# EasyEDA Pro project ProPrj_X-Link_V9.3_M_2024-11-03.epro

# Schematic X-Link_V9.3_M
Board Name: X-Link_V9.3_M; Create Date: 2024-10-04; Page Name: X-Link_V9.3_M; Project Name: X-Link_V9.3_M; Schematic Name: X-Link_V9.3_M; Update Date: 2024-10-04; Company: 嘉立创EDA; Page Size: A4; Version: V1.0
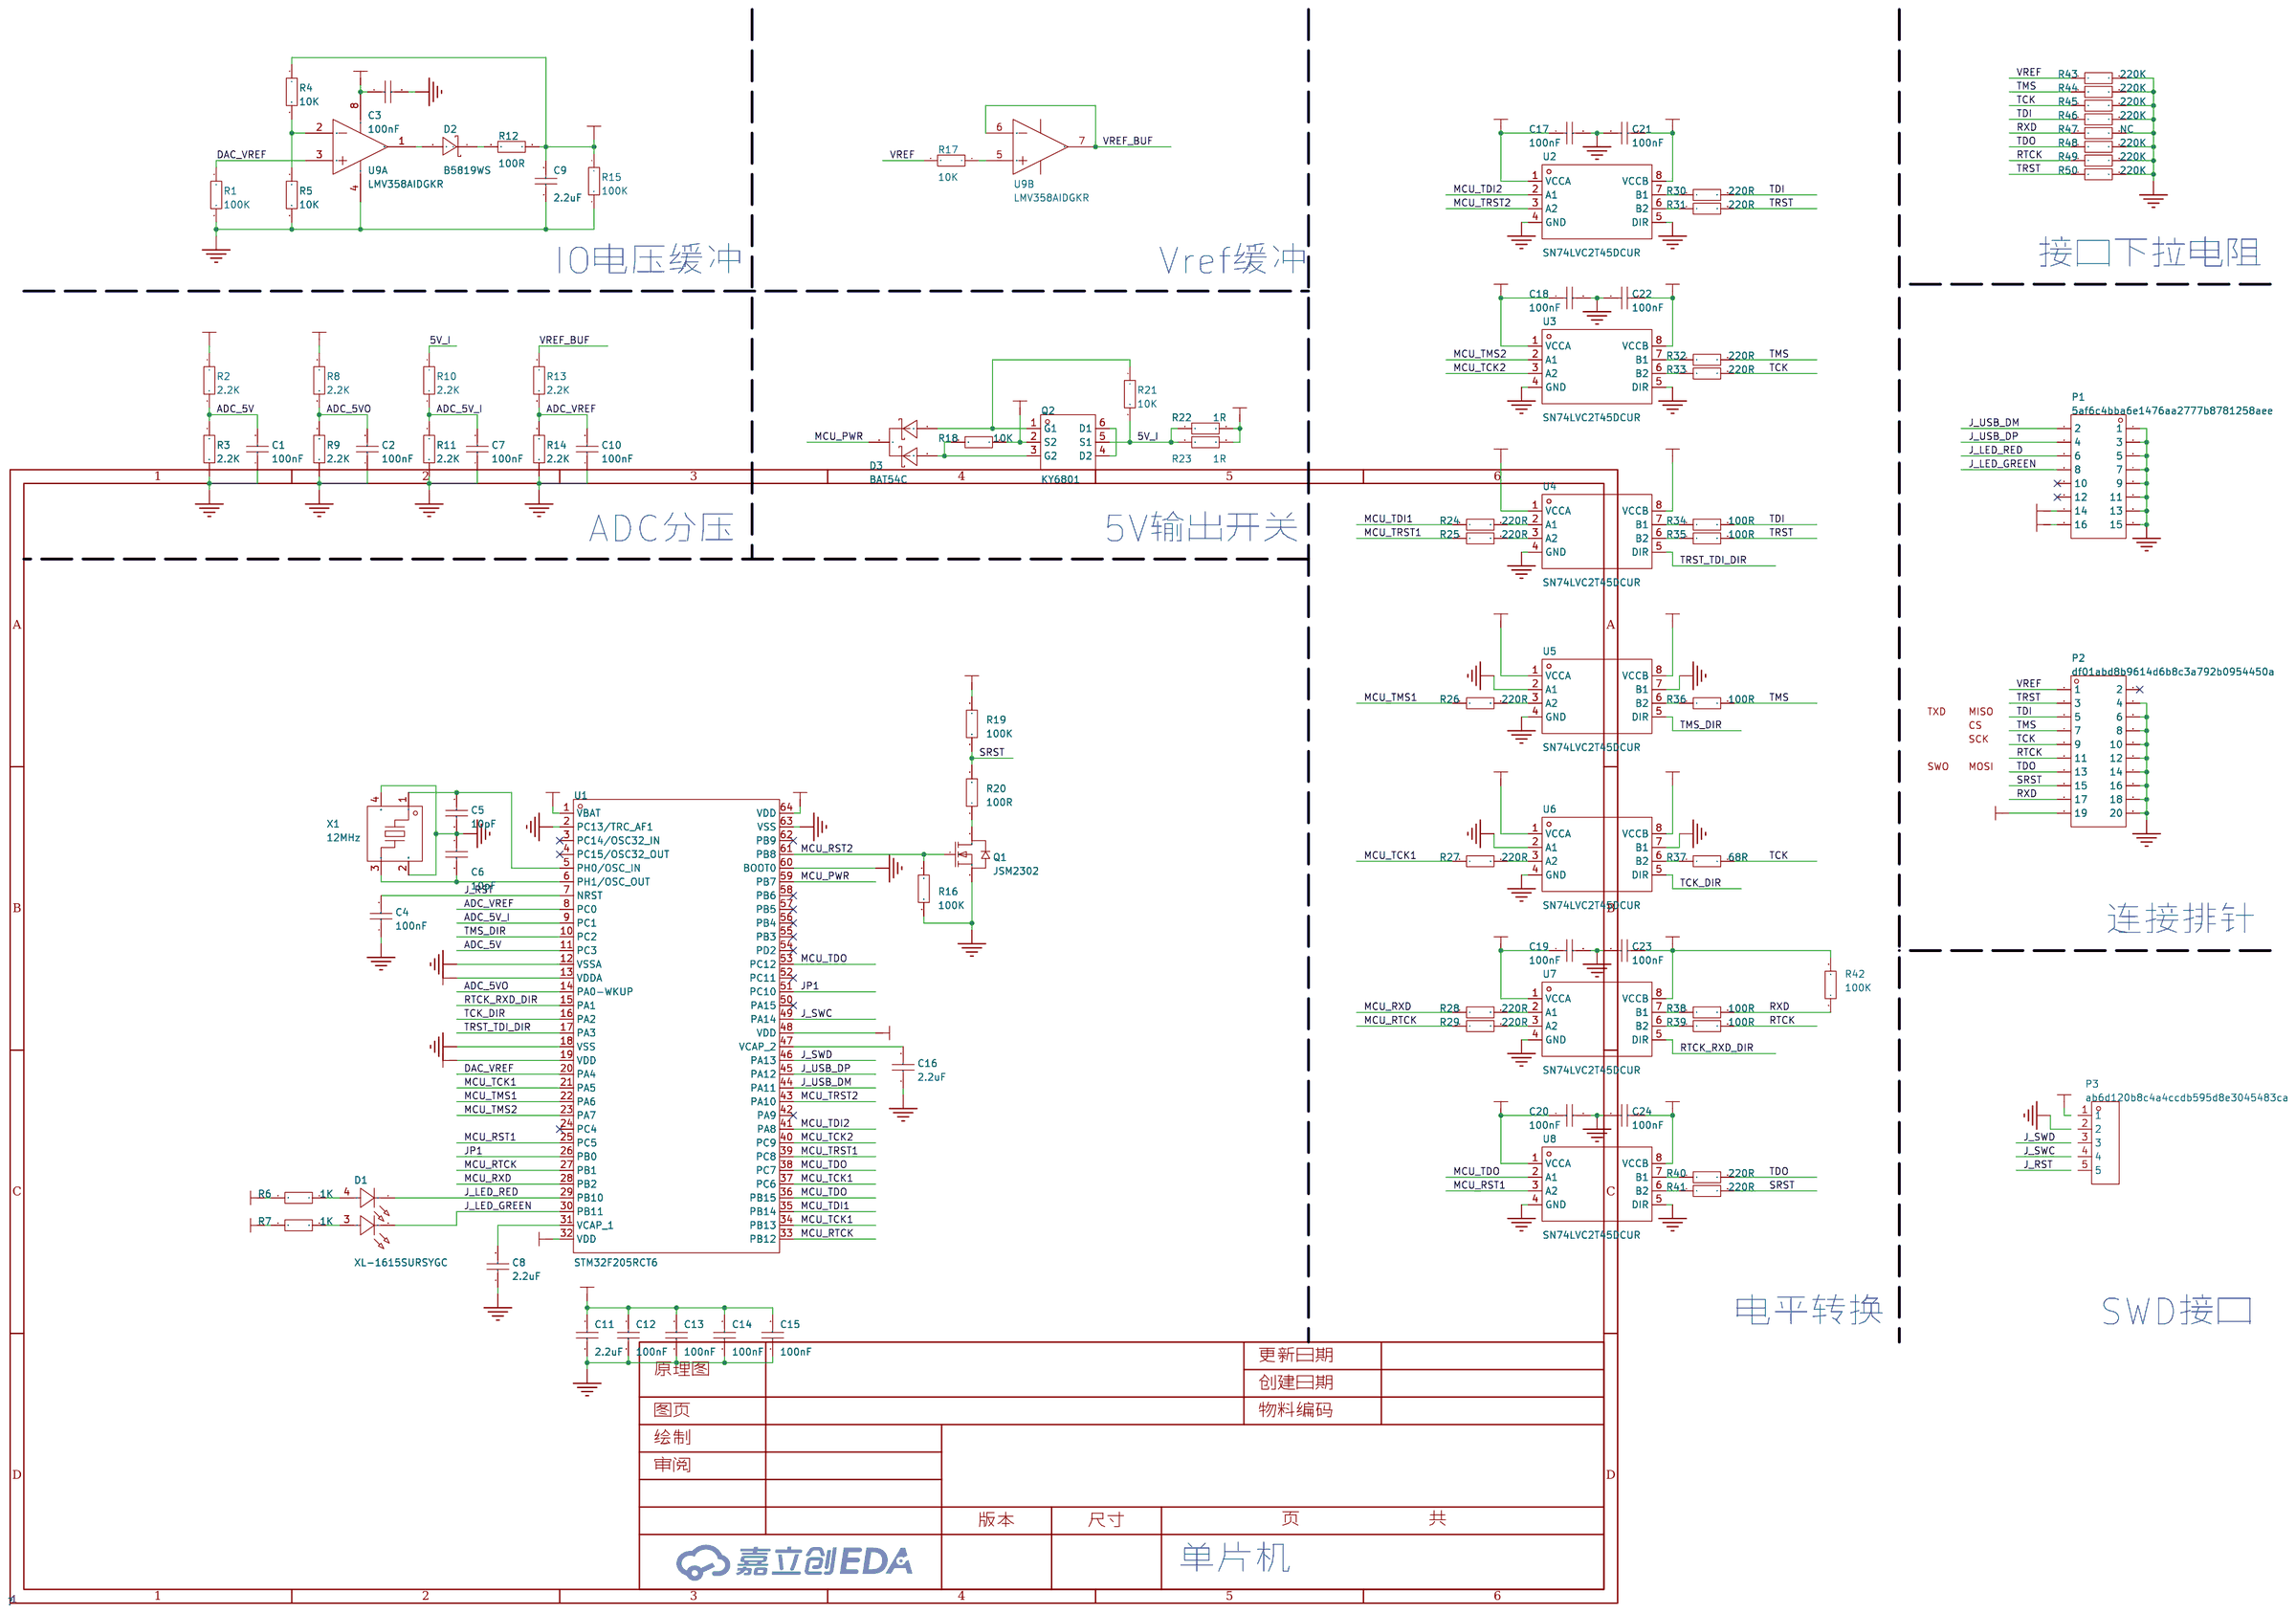
[diagram p0: schematic sheet]

## Parts
C1  100nF  [C0603]
C2  100nF  [C0603]
C3  100nF  [C0603]
C4  100nF  [C0603]
C5  10pF  [C0603]
C6  10pF  [C0603]
C7  100nF  [C0603]
C8  2.2uF  [C0603]
C9  2.2uF  [C0603]
C10  100nF  [C0603]
C11  2.2uF  [C0603]
C12  100nF  [C0603]
C13  100nF  [C0603]
C14  100nF  [C0603]
C15  100nF  [C0603]
C16  2.2uF  [C0603]
C17  100nF  [C0603]
C18  100nF  [C0603]
C19  100nF  [C0603]
C20  100nF  [C0603]
C21  100nF  [C0603]
C22  100nF  [C0603]
C23  100nF  [C0603]
C24  100nF  [C0603]
D1  XL-1615SURSYGC  [LED1615]
D2  B5819WS  [SOD-323_L1.8-W1.3-LS2.5-RD]
D3  BAT54C  [SOT-23-3_L2.9-W1.3-P1.90-LS2.4-BR]
P1  5af6c4bba6e1476aa2777b8781258aee  [HDR-TH_16P-P1.27-V-M-R2-C8-S1.27-1]
P2  df01abd8b9614d6b8c3a792b0954450a  [HDR-TH_20P-P1.27-V-M-R2-C10-S1.27]
P3  ab6d120b8c4a4ccdb595d8e3045483ca  [HDR-TH_5P-P1.27-V-M]
Q1  JSM2302  [SOT-23-3_L2.9-W1.3-P1.90-LS2.4-BR]
Q2  KY6801  [SOT-23-6_L2.9-W1.6-P0.95-LS2.8-BR]
R1  100K  [R0603]
R2  2.2K  [R0603]
R3  2.2K  [R0603]
R4  10K  [R0603]
R5  10K  [R0603]
R6  1K  [R0603]
R7  1K  [R0603]
R8  2.2K  [R0603]
R9  2.2K  [R0603]
R10  2.2K  [R0603]
R11  2.2K  [R0603]
R12  100R  [R0603]
R13  2.2K  [R0603]
R14  2.2K  [R0603]
R15  100K  [R0603]
R16  100K  [R0603]
R17  10K  [R0603]
R18  10K  [R0603]
R19  100K  [R0603]
R20  100R  [R0603]
R21  10K  [R0603]
R22  1R  [R0805]
R23  1R  [R0805]
R24  220R  [R0603]
R25  220R  [R0603]
R26  220R  [R0603]
R27  220R  [R0603]
R28  220R  [R0603]
R29  220R  [R0603]
R30  220R  [R0603]
R31  220R  [R0603]
R32  220R  [R0603]
R33  220R  [R0603]
R34  100R  [R0603]
R35  100R  [R0603]
R36  100R  [R0603]
R37  68R  [R0603]
R38  100R  [R0603]
R39  100R  [R0603]
R40  220R  [R0603]
R41  220R  [R0603]
R42  100K  [R0603]
R43  220K  [R0603]
R44  220K  [R0603]
R45  220K  [R0603]
R46  220K  [R0603]
R47  NC  [R0603]
R48  220K  [R0603]
R49  220K  [R0603]
R50  220K  [R0603]
U1  STM32F205RCT6  [LQFP-64_L10.0-W10.0-P0.50-LS12.0-BL]
U2  SN74LVC2T45DCUR  [VSSOP-8_L2.4-W2.1-P0.50-LS3.2-BR]
U3  SN74LVC2T45DCUR  [VSSOP-8_L2.4-W2.1-P0.50-LS3.2-BR]
U4  SN74LVC2T45DCUR  [VSSOP-8_L2.4-W2.1-P0.50-LS3.2-BR]
U5  SN74LVC2T45DCUR  [VSSOP-8_L2.4-W2.1-P0.50-LS3.2-BR]
U6  SN74LVC2T45DCUR  [VSSOP-8_L2.4-W2.1-P0.50-LS3.2-BR]
U7  SN74LVC2T45DCUR  [VSSOP-8_L2.4-W2.1-P0.50-LS3.2-BR]
U8  SN74LVC2T45DCUR  [VSSOP-8_L2.4-W2.1-P0.50-LS3.2-BR]
U9  LMV358AIDGKR  [VSSOP-8_L3.0-W3.0-P0.65-LS5.0-BL]  (sections 1,2)
X1  12MHz  [CRYSTAL-SMD_4P-L3.2-W2.5-BL-A]

## Library data of the parts
C1-C24 = C0603
D1 = LED1615: Emitted Color: 红色,黄绿色; Manufacturer: XINGLIGHT(成兴光); Supplier: LCSC; Supplier Part: C965838
D2 = B5819WS_C22624: 正向压降(Vf):600mV@1A;直流反向耐压(Vr):40V;平均整流电流(Io):1A;; LCSC Part Name: 电压:40V 电流:1A; Supplier Part: C22624; Manufacturer: CJ(江苏长电/长晶); Supplier Footprint: SOD-323; JLCPCB Part Class: 扩展库; Datasheet: https://atta.szlcsc.com/upload/public/pdf/source/20150407/1457707273359.pdf; Supplier: LCSC; Forward Voltage (Vf@If): 600mV@1A; Reverse Voltage (Vr): 40V; Average Rectified Current (Io): 1A
D3 = BAT54C_C916424: 二极管配置:1对共阴极;正向压降(Vf):1V@100mA;直流反向耐压(Vr):30V;整流电流:200mA;; LCSC Part Name: 电压:30V 电流:200mA; Supplier Part: C916424; Manufacturer: JSMSEMI(杰盛微); Supplier Footprint: SOT-23; JLCPCB Part Class: Extended Part; Datasheet: https://atta.szlcsc.com/upload/public/pdf/source/20230807/4DC032BFF2527F74FFA5A2420773D8A6.pdf; Supplier: LCSC; Diode Configuration: 1对共阴极; Forward Voltage (Vf@If): 1V@100mA; Reverse Voltage (Vr): 30V; Rectified Current: 200mA; Reverse Leakage Current (Ir): 2uA@25V
P1 = HDR2x8_1.27: 插针结构:2x8P;间距:1.27mm;行距:1.27mm;圆针/方针:方针;安装类型:直插;排数:双排;总PIN位数:16P;额定电流:1A;额定电压:500V;配合针长度:3.8mm;塑高:1mm;端接针长度:2.4mm;触头材质:黄铜;触头镀层:-;工作温度范围:-40℃~+105℃;焊接温度(最大值):260℃@10S;颜色:黑色;; LCSC Part Name: 2x8P 间距:1.27mm 方针 直插; Supplier Footprint: 插件,P=1.27mm; JLCPCB Part Class: 扩展库; Datasheet: https://atta.szlcsc.com/upload/public/pdf/source/20230314/463801427F572AD42B1A6214765822D0.pdf; Pin Structure: 2x8P; Pitch: 1.27mm; Row Spacing: 1.27mm; Circluar Pins/Square Pins: 方针; Mounting Type: 直插; Number of Rows: 双排; Number of Pins: 16P; Current Rating (Max): 1A; Voltage Rating (Max): 500V; Length of Mating Pin: 3.8mm; Insulation Height: 1mm; Length of End Connection Pin: 2.4mm; Contact Material: 黄铜; Operating Temperature Range: -40℃~+105℃; Soldering Temperature(Max): 260℃@10S; Color: 黑色
P2 = HDR2x10_1.27: 插针结构:2x10P;间距:1.27mm;行距:1.27mm;圆针/方针:方针;安装类型:直插;排数:双排;总PIN位数:20P;额定电流:1A;额定电压:500V;配合针长度:3.8mm;塑高:1mm;端接针长度:2.4mm;触头材质:黄铜;触头镀层:-;工作温度范围:-40℃~+105℃;焊接温度(最大值):260℃@10S;颜色:黑色;; LCSC Part Name: 2x10P 间距:1.27mm 方针 直插; Supplier Footprint: 插件,P=1.27mm; JLCPCB Part Class: 扩展库; Datasheet: https://atta.szlcsc.com/upload/public/pdf/source/20240702/A94E5E2C58EC168531668174128D95E4.pdf; Pin Structure: 2x10P; Pitch: 1.27mm; Row Spacing: 1.27mm; Circluar Pins/Square Pins: 方针; Mounting Type: 直插; Number of Rows: 双排; Number of Pins: 20P; Current Rating (Max): 1A; Voltage Rating (Max): 500V; Length of Mating Pin: 3.8mm; Insulation Height: 1mm; Length of End Connection Pin: 2.4mm; Contact Material: 黄铜; Operating Temperature Range: -40℃~+105℃; Soldering Temperature(Max): 260℃@10S; Color: 黑色
P3 = HDR1x5_1.27: 插针结构:1x5P;间距:1.27mm;行距:-;圆针/方针:方针;安装类型:直插;排数:单排;总PIN位数:5P;额定电流:1A;额定电压:250V;配合针长度:3.8mm;塑高:1mm;端接针长度:2.4mm;触头材质:黄铜;触头镀层:-;工作温度范围:-40℃~+105℃;焊接温度(最大值):260℃@10S;颜色:黑色;; LCSC Part Name: 1x5P 间距:1.27mm 方针 直插; Supplier Footprint: 插件,P=1.27mm; JLCPCB Part Class: 扩展库; Datasheet: https://atta.szlcsc.com/upload/public/pdf/source/20230316/674E7855FAF1BFD827413D68A2D1697C.pdf; Pin Structure: 1x5P; Pitch: 1.27mm; Circluar Pins/Square Pins: 方针; Mounting Type: 直插; Number of Rows: 单排; Number of Pins: 5P; Current Rating (Max): 1A; Voltage Rating (Max): 250V; Length of Mating Pin: 3.8mm; Insulation Height: 1mm; Length of End Connection Pin: 2.4mm; Contact Material: 黄铜; Operating Temperature Range: -40℃~+105℃; Soldering Temperature(Max): 260℃@10S; Color: 黑色
Q1 = JSM2302: 类型:1个N沟道;漏源电压(Vdss):20V;连续漏极电流(Id):6A;导通电阻(RDS(on)@Vgs,Id):60mΩ@4.5V,3.6A;功率(Pd):1.25W;阈值电压(Vgs(th)@Id):1.2V@250uA;; LCSC Part Name: 1个N沟道 耐压:20V 电流:6A; Supplier Part: C916403; Manufacturer: JSMSEMI(杰盛微); Supplier Footprint: SOT-23; JLCPCB Part Class: Extended Part; Datasheet: https://atta.szlcsc.com/upload/public/pdf/source/20230807/04B947337E4164AAEE3E50621783DB01.pdf; Supplier: LCSC; Type: 1个N沟道; Drain Source Voltage (Vdss): 20V; Continuous Drain Current (Id): 6A; Drain Source On Resistance (RDS(on)@Vgs,Id): 60mΩ@4.5V,3.6A; Power Dissipation (Pd): 1.25W; Gate Threshold Voltage (Vgs(th)@Id): 1.2V@250uA; Input Capacitance (Ciss@Vds): 300pF@15V; Reverse Transfer Capacitance (Crss@Vds): 80pF@15V
Q2 = KY6801: 类型:2个P沟道;漏源电压(Vdss):20V;连续漏极电流(Id):2A;功率(Pd):800mW;导通电阻(RDS(on)@Vgs,Id):120mΩ@4.5V,2A;阈值电压(Vgs(th)@Id):650mV@250uA;; LCSC Part Name: 2个P沟道 耐压:20V 电流:2A; Supplier Part: C3029283; Manufacturer: KY(韩景元); Supplier Footprint: SOT-23-6L; JLCPCB Part Class: Extended Part; Datasheet: https://atta.szlcsc.com/upload/public/pdf/source/20220602/4088AB0D899E527C37AFDEC1350C0A99.pdf; Supplier: LCSC; Type: 2个P沟道; Drain Source Voltage (Vdss): 20V; Continuous Drain Current (Id): 2A; Power Dissipation (Pd): 800mW; Drain Source On Resistance (RDS(on)@Vgs,Id): 120mΩ@4.5V,2A; Gate Threshold Voltage (Vgs(th)@Id): 650mV@250uA; Total Gate Charge (Qg@Vgs): 5.3nC@4.5V; Input Capacitance (Ciss@Vds): 250pF@10V; Reverse Transfer Capacitance (Crss@Vds): 18pF@10V; Operating Temperature: -55℃~+150℃@(Tj)
R1-R21 R24-R50 = R0603
R22 R23 = R0805: Tolerance: ±1%; Power(Watts): 125mW; Overload Voltage (Max): 150V
U1 = STM32F205RCT6: CPU内核:CM3;程序存储容量:256KB;GPIO端口数量:51;工作电压范围:1.8V~3.6V;CPU最大主频:120MHz;; Supplier Part: C47520; Manufacturer: ST(意法半导体); Supplier Footprint: LQFP-64(10x10); JLCPCB Part Class: 扩展库; Datasheet: https://atta.szlcsc.com/upload/public/pdf/source/20151106/1457707552494.pdf; Supplier: LCSC; CPU Core: CM3; Program Storage Size: 256KB; GPIO Ports Number: 51; Operating Voltage Range: 1.8V~3.6V; CPU Maximum Speed: 120MHz; Operating Temperature Range: -40℃~+85℃; ADC (Bit): 12bit; DAC (Bit): 12bit; Universal Serial Bus: 有; Watchdog: 有; Infrared Data Association: 有; Low-Voltage Detect: 有; LCD Module: 有; Direct Memory Access: 有; Internal Oscillator: 有
U2-U8 = SN74LVC2T45DCUR: SN74LVC2T45 具有可配置电压转换和三态输出的 2 位双电源总线收发器; Supplier Part: C15741; Manufacturer: TI(德州仪器); Supplier Footprint: VSSOP-8-0.5mm; JLCPCB Part Class: 扩展库; Datasheet: https://www.ti.com/cn/lit/gpn/sn74lvc2t45; Supplier: LCSC
U9 = LMV358AIDGKR: 放大器数:双路;增益带宽积(GBP):1MHz;输入偏置电流(Ib):10pA;压摆率(SR):1.7V/us;带宽(-3db):-;轨到轨:-;; Supplier Part: C408974; Manufacturer: TI(德州仪器); Supplier Footprint: VSSOP-8; JLCPCB Part Class: 扩展库; Datasheet: https://www.ti.com/cn/lit/gpn/lmv358a; Supplier: LCSC; Number of Circuits: 双路; Gain Bandwidth Product(GBP): 1MHz; Current - Input Bias(Ib): 10pA; Slew Rate(SR): 1.7V/us; Output Current: 40mA; Operating Temperature: -40℃~+125℃
X1 = XTAL3225

## Nets
3.3V: C11.2 C12.2 C13.2 C14.2 C15.2 C17.1 C18.1 C19.1 C20.1 P1.14 R6.2 R7.2 U1.1(VBAT) U1.13(VDDA) U1.19(VDD) U1.32(VDD) U1.48(VDD) U1.64(VDD) U2.1(VCCA) U3.1(VCCA) U4.1(VCCA) U5.1(VCCA) U6.1(VCCA) U7.1(VCCA) U8.1(VCCA)
5V: C3.1 P1.16 R2.1 R22.2 R23.2 U9.8(V+)
5V_I: Q2.5(S1) R10.1 R21.2 R22.1 R23.1
5V_OUT: P2.19 Q2.2(S2) R8.1 R18.1
GND: C1.1 C2.1 C3.2 C4.1 C5.2 C6.1 C7.1 C8.1 C9.1 C10.1 C11.1 C12.1 C13.1 C14.1 C15.1 C16.1 C17.2 C18.2 C19.2 C20.2 C21.1 C22.1 C23.1 C24.1 P1.1 P1.3 P1.5 P1.7 P1.9 P1.11 P1.13 P1.15 P2.4 P2.6 P2.8 P2.10 P2.12 P2.14 P2.16 P2.18 P2.20 Q1.2(S) R1.2 R3.2 R5.2 R9.2 R11.2 R14.2 R15.2 R16.2 R43.2 R44.2 R45.2 R46.2 R47.2 R48.2 R49.2 R50.2 U1.2(PC13/TRC_AF1) U1.12(VSSA) U1.18(VSS) U1.60(BOOT0) U1.63(VSS) U2.4(GND) U2.5(DIR) U3.4(GND) U3.5(DIR) U4.4(GND) U5.2(A1) U5.4(GND) U5.7(B1) U6.2(A1) U6.4(GND) U6.7(B1) U7.4(GND) U8.4(GND) U8.5(DIR) U9.4(V-) X1.2(GND) X1.4(GND)
ADC_5V: C1.2 R2.2 R3.1 U1.11(PC3)
ADC_5V_I: C7.2 R10.2 R11.1 U1.9(PC1)
ADC_5VO: C2.2 R8.2 R9.1 U1.14(PA0-WKUP)
ADC_VREF: C10.2 R13.2 R14.1 U1.8(PC0)
DAC_VREF: R1.1 U1.20(PA4) U9.3(+INA)
J_LED_GREEN: D1.2(K) P1.8 U1.30(PB11)
J_LED_RED: D1.1(K) P1.6 U1.29(PB10)
J_RST: C4.2 U1.7(NRST)
J_SWC: U1.49(PA14)
J_SWD: U1.46(PA13)
J_USB_DM: P1.2 U1.44(PA11)
J_USB_DP: P1.4 U1.45(PA12)
JP1: U1.26(PB0) U1.51(PC10)
MCU_PWR: D3.3(K) U1.59(PB7)
MCU_RST1: U1.25(PC5) U8.3(A2)
MCU_RST2: Q1.1(G) R16.1 U1.61(PB8)
MCU_RTCK: R29.1 U1.27(PB1) U1.33(PB12)
MCU_RXD: R28.1 U1.28(PB2)
MCU_TCK1: R27.1 U1.21(PA5) U1.34(PB13) U1.37(PC6)
MCU_TCK2: U1.40(PC9) U3.3(A2)
MCU_TDI1: R24.1 U1.35(PB14)
MCU_TDI2: U1.41(PA8) U2.2(A1)
MCU_TDO: U1.36(PB15) U1.38(PC7) U1.53(PC12) U8.2(A1)
MCU_TMS1: R26.1 U1.22(PA6)
MCU_TMS2: U1.23(PA7) U3.2(A1)
MCU_TRST1: R25.1 U1.39(PC8)
MCU_TRST2: U1.43(PA10) U2.3(A2)
RTCK: P2.11 R39.2 R49.1
RTCK_RXD_DIR: U1.15(PA1) U7.5(DIR)
RXD: P2.17 R38.2 R42.1 R47.1
SRST: P2.15 R19.2 R20.2 R41.2
TCK: P2.9 R33.2 R37.2 R45.1
TCK_DIR: U1.16(PA2) U6.5(DIR)
TDI: P2.5 R30.2 R34.2 R46.1
TDO: P2.13 R40.2 R48.1
TMS: P2.7 R32.2 R36.2 R44.1
TMS_DIR: U1.10(PC2) U5.5(DIR)
TRST: P2.3 R31.2 R35.2 R50.1
TRST_TDI_DIR: U1.17(PA3) U4.5(DIR)
VIO: C9.2 C21.2 C22.2 C23.2 C24.2 R4.1 R12.1 R15.1 R19.1 R42.2 U2.8(VCCB) U3.8(VCCB) U4.8(VCCB) U5.8(VCCB) U6.8(VCCB) U7.8(VCCB) U8.8(VCCB)
VREF: P2.1 R17.2 R43.1
VREF_BUF: R13.1 U9.6(-INB) U9.7(OUTB)
$1N1650: R31.1 U2.6(B2)
$1N1652: R30.1 U2.7(B1)
$1N2320: R32.1 U3.7(B1)
$1N2323: R33.1 U3.6(B2)
$1N2654: R34.1 U4.7(B1)
$1N2657: R35.1 U4.6(B2)
$1N2922: R36.1 U5.6(B2)
$1N3257: R24.2 U4.2(A1)
$1N3292: R25.2 U4.3(A2)
$1N3327: R26.2 U5.3(A2)
$1N3604: R27.2 U6.3(A2)
$1N3606: R37.1 U6.6(B2)
$1N3911: R38.1 U7.7(B1)
$1N3912: R39.1 U7.6(B2)
$1N3913: R28.2 U7.2(A1)
$1N3915: R29.2 U7.3(A2)
$1N4922: R40.1 U8.7(B1)
$1N4923: R41.1 U8.6(B2)
$1N5088: C5.1 U1.5(PH0/OSC_IN) X1.1
$1N5089: C6.2 U1.6(PH1/OSC_OUT) X1.3
$1N5338: C16.2 U1.47(VCAP_2)
$1N5416: C8.2 U1.31(VCAP_1)
$1N6080: D1.4(A) R6.1
$1N6144: D1.3(A) R7.1
$1N6676: R17.1 U9.5(+INB)
$1N6686: R4.2 R5.1 U9.2(-INA)
$1N9976: D2.2(A) U9.1(OUTA)
$1N10015: D2.1(K) R12.2
$1N10974: D3.2(A2) Q2.1(G1) R21.1
$1N10976: D3.1(A1) Q2.3(G2) R18.2
$1N10979: Q2.4(D2) Q2.6(D1)
$1N11150: Q1.3(D) R20.1

Not connected (* = marked no-connect by the designer): P1 10* 12*; P2 2*; P3 1 2 3 4 5; U1 3(PC14/OSC32_IN)* 4(PC15/OSC32_OUT)* 24(PC4)* 42(PA9)* 50(PA15)* 52(PC11)* 54(PD2)* 55(PB3)* 56(PB4)* 57(PB5)* 58(PB6)* 62(PB9)*

## Notes on the sheet
- 接口下拉电阻
- IO电压缓冲
- Vref缓冲
- ADC分压
- 5V输出开关
- TXD
- CS
- MISO
- SCK
- SWO
- MOSI
- 连接排针
- 电平转换
- SWD接口
- 单片机

# Board X-Link_V9.3_M
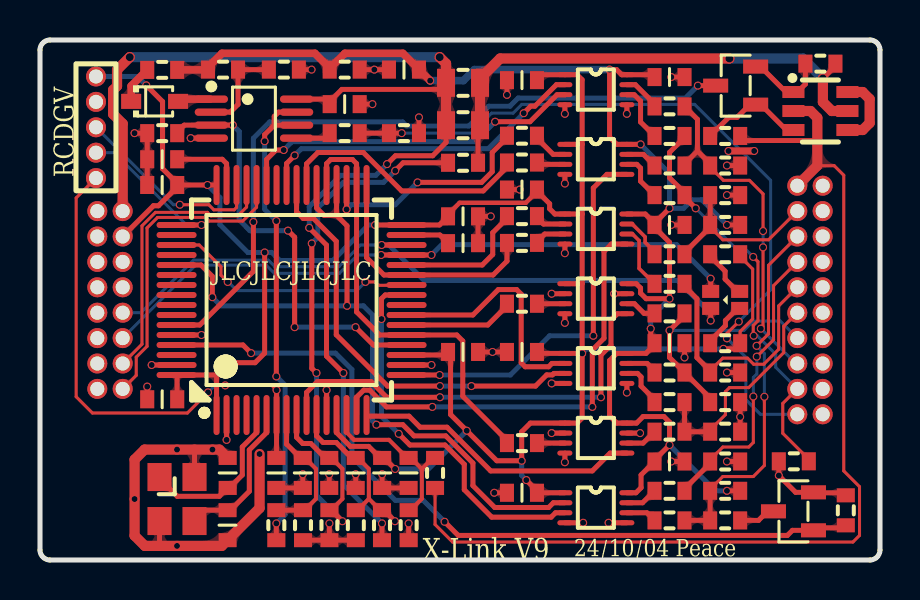
[diagram p1: board, top side]
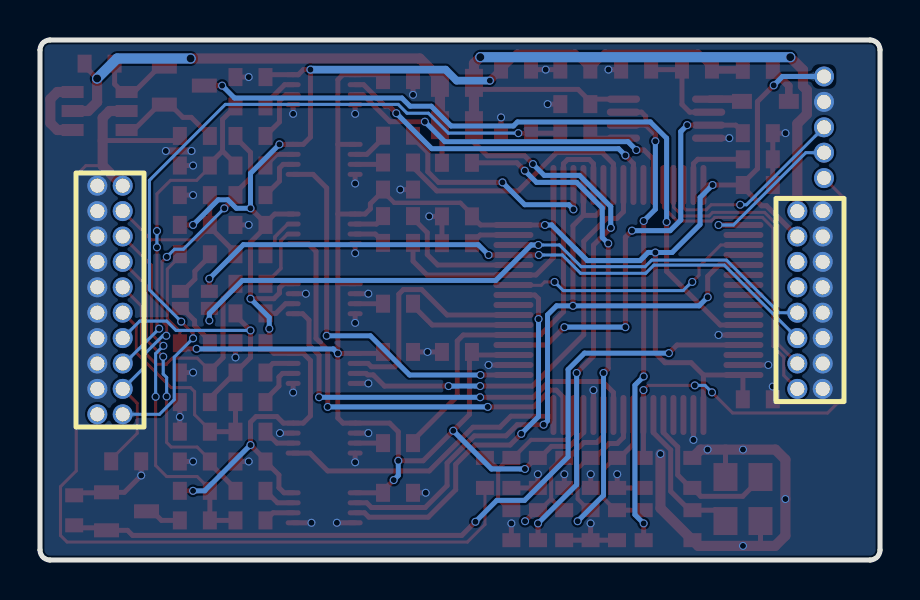
[diagram p2: board, bottom side, seen from below]

Outline 42 x 26 mm; copper layers: Top Layer, Bottom Layer. Coordinates in mm from the lower left corner of the outline.
Outline path: 0,25.5 0,0.5 arc(0.15,0.15) 0.5,0 41.5,0 arc(41.85,0.15) 42,0.5 42,25.5 arc(41.85,25.85) 41.5,26 0.5,26 arc(0.15,25.85) 0,25.5
Stack: Top Layer 0.035mm / Dielectric1 1.51mm FR4 er 4.5 / Bottom Layer 0.035mm

## Design rules (mm)
template: 双面板
spacing copperThickness1oz (default): track to track 0.102, other pairs 0.102 to 0.201
spacing copperThickness2oz: track to track 0.203, other pairs 0.152 to 0.3
track width copperThickness1oz (default): min 0.102, default 0.152, max 2.54
track width copperThickness2oz: min 0.203, default 0.254, max 2.54
differential pair differentialPair (default): width min 0.127, default 0.254, max 2.54; gap min 0.152, default 0.152
via viaSize (default): diameter min 0.399, default 0.399, max 10; hole min 0.3, default 0.3, max 6.299

## Placement (name value [footprint] x y rotation side)
C1  100nF  [C0603]  15.79 4.35 90 top
C2  100nF  [C0603]  18.43 4.35 90 top
C3  100nF  [C0603]  15.23 22.79 0 top
C4  100nF  [C0603]  11.82 4.35 90 top
C5  10pF  [C0603]  9.39 4.35 90 top
C6  10pF  [C0603]  9.38 1.74 90 top
C7  100nF  [C0603]  14.46 4.35 90 top
C8  2.2uF  [C0603]  21.15 15.84 180 top
C9  2.2uF  [C0603]  18.2 24.52 0 top
C10  100nF  [C0603]  13.14 4.35 90 top
C11  2.2uF  [C0603]  21.15 10.4 180 top
C12  100nF  [C0603]  21.15 17.18 180 top
C13  100nF  [C0603]  17.11 4.35 90 top
C14  100nF  [C0603]  6.11 18.75 0 top
C15  100nF  [C0603]  6.11 8.04 0 top
C16  2.2uF  [C0603]  6.11 20.04 0 top
C17  100nF  [C0603]  24.1 23.99 180 top
C18  100nF  [C0603]  24.1 10.4 180 top
C19  100nF  [C0603]  24.1 18.52 180 top
C20  100nF  [C0603]  24.1 3.36 180 top
C21  100nF  [C0603]  31.48 24.15 180 top
C22  100nF  [C0603]  31.48 10.84 180 top
C23  100nF  [C0603]  31.48 16.75 180 top
C24  100nF  [C0603]  31.48 4.93 180 top
D1  XL-1615SURSYGC  [LED1615]  34.26 13.01 0 top
D2  B5819WS  [SOD-323_L1.8-W1.3-LS2.5-RD]  5.73 22.93 0 top
D3  BAT54C  [SOT-23-3_L2.9-W1.3-P1.90-LS2.4-BR]  34.78 23.72 0 top
P1  5af6c4bba6e1476aa2777b8781258aee  [HDR-TH_16P-P1.27-V-M-R2-C8-S1.27-1]  3.5 13 90 bottom
P2  df01abd8b9614d6b8c3a792b0954450a  [HDR-TH_20P-P1.27-V-M-R2-C10-S1.27]  38.5 13 90 bottom
P3  ab6d120b8c4a4ccdb595d8e3045483ca  [HDR-TH_5P-P1.27-V-M]  2.8 21.64 270 top
Q1  JSM2302  [SOT-23-3_L2.9-W1.3-P1.90-LS2.4-BR]  37.67 2.43 0 top
Q2  KY6801  [SOT-23-6_L2.9-W1.6-P0.95-LS2.8-BR]  39.02 22.45 180 top
R1  100K  [R0603]  6.11 21.34 180 top
R2  2.2K  [R0603]  17.1 1.74 90 top
R3  2.2K  [R0603]  15.79 1.74 270 top
R4  10K  [R0603]  9.15 24.52 0 top
R5  10K  [R0603]  12.19 24.52 0 top
R6  1K  [R0603]  34.26 15.29 0 top
R7  1K  [R0603]  34.26 10.84 0 top
R8  2.2K  [R0603]  19.75 4.35 90 top
R9  2.2K  [R0603]  18.43 1.74 270 top
R10  2.2K  [R0603]  21.15 19.86 180 top
R11  2.2K  [R0603]  14.47 1.74 270 top
R12  100R  [R0603]  6.11 24.51 180 top
R13  2.2K  [R0603]  11.82 1.74 90 top
R14  2.2K  [R0603]  13.15 1.74 270 top
R15  100K  [R0603]  15.23 24.52 0 top
R16  100K  [R0603]  40.29 2.48 90 top
R17  10K  [R0603]  15.23 21.34 0 top
R18  10K  [R0603]  34.26 21.2 180 top
R19  100K  [R0603]  34.26 3.46 180 top
R20  100R  [R0603]  34.26 1.98 180 top
R21  10K  [R0603]  39.02 24.82 0 top
R22  1R  [R0805]  21.15 23.86 180 top
R23  1R  [R0805]  21.15 21.74 180 top
R24  220R  [R0603]  24.1 21.21 0 top
R25  220R  [R0603]  24.1 19.87 0 top
R26  220R  [R0603]  24.1 12.81 0 top
R27  220R  [R0603]  24.1 5.85 0 top
R28  220R  [R0603]  24.1 17.19 0 top
R29  220R  [R0603]  24.1 15.86 0 top
R30  220R  [R0603]  31.48 22.68 0 top
R31  220R  [R0603]  31.48 21.2 0 top
R32  220R  [R0603]  31.48 9.37 0 top
R33  220R  [R0603]  31.48 7.89 0 top
R34  100R  [R0603]  31.48 19.72 0 top
R35  100R  [R0603]  31.48 18.24 0 top
R36  100R  [R0603]  31.48 12.33 0 top
R37  68R  [R0603]  31.48 6.42 0 top
R38  100R  [R0603]  31.48 15.29 0 top
R39  100R  [R0603]  31.48 13.81 0 top
R40  220R  [R0603]  31.48 3.46 0 top
R41  220R  [R0603]  31.48 1.98 0 top
R42  100K  [R0603]  34.26 16.75 0 top
R43  220K  [R0603]  18.2 21.34 0 top
R44  220K  [R0603]  34.26 7.89 0 top
R45  220K  [R0603]  34.26 6.42 0 top
R46  220K  [R0603]  34.26 19.72 0 top
R47  NC  [R0603]  34.26 18.24 0 top
R48  220K  [R0603]  34.26 4.93 0 top
R49  220K  [R0603]  34.26 9.37 0 top
R50  220K  [R0603]  37.69 4.94 180 top
U1  STM32F205RCT6  [LQFP-64_L10.0-W10.0-P0.50-LS12.0-BL]  12.58 13 0 top
U2  SN74LVC2T45DCUR  [VSSOP-8_L2.4-W2.1-P0.50-LS3.2-BR]  27.79 23.52 180 top
U3  SN74LVC2T45DCUR  [VSSOP-8_L2.4-W2.1-P0.50-LS3.2-BR]  27.79 9.58 180 top
U4  SN74LVC2T45DCUR  [VSSOP-8_L2.4-W2.1-P0.50-LS3.2-BR]  27.79 20.03 180 top
U5  SN74LVC2T45DCUR  [VSSOP-8_L2.4-W2.1-P0.50-LS3.2-BR]  27.79 13.06 180 top
U6  SN74LVC2T45DCUR  [VSSOP-8_L2.4-W2.1-P0.50-LS3.2-BR]  27.79 6.1 180 top
U7  SN74LVC2T45DCUR  [VSSOP-8_L2.4-W2.1-P0.50-LS3.2-BR]  27.79 16.55 180 top
U8  SN74LVC2T45DCUR  [VSSOP-8_L2.4-W2.1-P0.50-LS3.2-BR]  27.79 2.61 180 top
U9  LMV358AIDGKR  [VSSOP-8_L3.0-W3.0-P0.65-LS5.0-BL]  10.7 22.07 270 top
X1  12MHz  [CRYSTAL-SMD_4P-L3.2-W2.5-BL-A]  6.85 3.05 270 top

## Footprints (pads in the part's own frame, mm; a bottom-side part is the same pattern mirrored in y, then rotated)
C0603
  rect 0.7x0.9 smd: 1(-0.75,0) 2(0.75,0)
CRYSTAL-SMD_4P-L3.2-W2.5-BL-A
  rect 1.4x1.2 smd: 1(-1.1,-0.875) 2(1.1,-0.875) 3(1.1,0.875) 4(-1.1,0.875)
HDR-TH_5P-P1.27-V-M
  rrect 1x1 hole 0.7: 1(-2.54,0)
  round 1 hole 0.7: 2(-1.27,0) 3(0,0) 4(1.27,0) 5(2.54,0)
HDR-TH_16P-P1.27-V-M-R2-C8-S1.27-1
  rrect 1x1 hole 0.7: 1(-4.445,-0.635)
  round 1 hole 0.7: 2(-4.445,0.635) 3(-3.175,-0.635) 4(-3.175,0.635) 5(-1.905,-0.635) 6(-1.905,0.635) 7(-0.635,-0.635) 8(-0.635,0.635) 9(0.635,-0.635) 10(0.635,0.635) 11(1.905,-0.635) 12(1.905,0.635) 13(3.175,-0.635) 14(3.175,0.635) 15(4.445,-0.635) 16(4.445,0.635)
HDR-TH_20P-P1.27-V-M-R2-C10-S1.27
  rrect 1x1 hole 0.7: 1(-5.715,-0.635)
  round 1 hole 0.7: 2(-5.715,0.635) 3(-4.445,-0.635) 4(-4.445,0.635) 5(-3.175,-0.635) 6(-3.175,0.635) 7(-1.905,-0.635) 8(-1.905,0.635) 9(-0.635,-0.635) 10(-0.635,0.635) 11(0.635,-0.635) 12(0.635,0.635) 13(1.905,-0.635) 14(1.905,0.635) 15(3.175,-0.635) 16(3.175,0.635) 17(4.445,-0.635) 18(4.445,0.635) 19(5.715,-0.635) 20(5.715,0.635)
LED1615
  rect 0.85x0.65 smd: 1(-0.725,0.425) 2(-0.725,-0.425) 3(0.725,-0.425) 4(0.725,0.425)
LQFP-64_L10.0-W10.0-P0.50-LS12.0-BL
  oval 0.3x2 smd: 1(-3.75,-5.75) 2(-3.25,-5.75) 3(-2.75,-5.75) 4(-2.25,-5.75) 5(-1.75,-5.75) 6(-1.25,-5.75) 7(-0.75,-5.75) 8(-0.25,-5.75) 9(0.25,-5.75) 10(0.75,-5.75) 11(1.25,-5.75) 12(1.75,-5.75) 13(2.25,-5.75) 14(2.75,-5.75) 15(3.25,-5.75) 16(3.75,-5.75) 33(3.75,5.75) 34(3.25,5.75) 35(2.75,5.75) 36(2.25,5.75) 37(1.75,5.75) 38(1.25,5.75) 39(0.75,5.75) 40(0.25,5.75) 41(-0.25,5.75) 42(-0.75,5.75) 43(-1.25,5.75) 44(-1.75,5.75) 45(-2.25,5.75) 46(-2.75,5.75) 47(-3.25,5.75) 48(-3.75,5.75)
  oval 2x0.3 smd: 17(5.75,-3.75) 18(5.75,-3.25) 19(5.75,-2.75) 20(5.75,-2.25) 21(5.75,-1.75) 22(5.75,-1.25) 23(5.75,-0.75) 24(5.75,-0.25) 25(5.75,0.25) 26(5.75,0.75) 27(5.75,1.25) 28(5.75,1.75) 29(5.75,2.25) 30(5.75,2.75) 31(5.75,3.25) 32(5.75,3.75) 49(-5.75,3.75) 50(-5.75,3.25) 51(-5.75,2.75) 52(-5.75,2.25) 53(-5.75,1.75) 54(-5.75,1.25) 55(-5.75,0.75) 56(-5.75,0.25) 57(-5.75,-0.25) 58(-5.75,-0.75) 59(-5.75,-1.25) 60(-5.75,-1.75) 61(-5.75,-2.25) 62(-5.75,-2.75) 63(-5.75,-3.25) 64(-5.75,-3.75)
R0603
  rect 0.7x0.9 smd: 1(-0.75,0) 2(0.75,0)
R0805
  rect 0.9x1.4 smd: 1(-0.85,0) 2(0.85,0)
SOD-323_L1.8-W1.3-LS2.5-RD
  rect 1x0.75 smd: 1(-1.173,0) 2(1.173,0)
SOT-23-3_L2.9-W1.3-P1.90-LS2.4-BR
  rect 1.25x0.7 smd: 1(1,-0.95) 2(1,0.95) 3(-1,0)
SOT-23-6_L2.9-W1.6-P0.95-LS2.8-BR
  rect 1.1x0.6 smd: 1(1.35,-0.95) 2(1.35,0) 3(1.35,0.95) 4(-1.35,0.95) 5(-1.35,0) 6(-1.35,-0.95)
VSSOP-8_L2.4-W2.1-P0.50-LS3.2-BR
  oval 0.75x0.25 smd: 1(1.55,-0.75) 2(1.55,-0.25) 3(1.55,0.25) 4(1.55,0.75) 5(-1.55,0.75) 6(-1.55,0.25) 7(-1.55,-0.25) 8(-1.55,-0.75)
VSSOP-8_L3.0-W3.0-P0.65-LS5.0-BL
  oval 0.364x1.662 smd: 1(-0.975,-2.131) 2(-0.325,-2.131) 3(0.325,-2.131) 4(0.975,-2.131) 5(0.975,2.131) 6(0.325,2.131) 7(-0.325,2.131) 8(-0.975,2.131)

## Nets
As in the schematic, except:
3.3V: C11.2 C12.2 C13.2 C14.2 C15.2 C17.1 C18.1 C19.1 C20.1 P1.14 P3.1 R6.2 R7.2 U1.1 U1.13 U1.19 U1.32 U1.48 U1.64 U2.1 U3.1 U4.1 U5.1 U6.1 U7.1 U8.1
GND: C1.1 C2.1 C3.2 C4.1 C5.2 C6.1 C7.1 C8.1 C9.1 C10.1 C11.1 C12.1 C13.1 C14.1 C15.1 C16.1 C17.2 C18.2 C19.2 C20.2 C21.1 C22.1 C23.1 C24.1 P1.1 P1.3 P1.5 P1.7 P1.9 P1.11 P1.13 P1.15 P2.4 P2.6 P2.8 P2.10 P2.12 P2.14 P2.16 P2.18 P2.20 P3.2 Q1.2 R1.2 R3.2 R5.2 R9.2 R11.2 R14.2 R15.2 R16.2 R43.2 R44.2 R45.2 R46.2 R47.2 R48.2 R49.2 R50.2 U1.2 U1.12 U1.18 U1.60 U1.63 U2.4 U2.5 U3.4 U3.5 U4.4 U5.2 U5.4 U5.7 U6.2 U6.4 U6.7 U7.4 U8.4 U8.5 U9.4 X1.2 X1.4
J_RST: C4.2 P3.5 U1.7
J_SWC: P3.4 U1.49
J_SWD: P3.3 U1.46

Pads without a net: P1 10 12; P2 2; U1 3 4 24 42 50 52 54 55 56 57 58 62

## Via types
v1: diameter 0.4, hole 0.3, Top Layer to Bottom Layer, 139 vias
v2: diameter 0.5, hole 0.4, Top Layer to Bottom Layer, 4 vias

## Routing (per net, layer and track width the routed paths; a pad name or vN(x,y) marks a point on that pad's centre or on a via; arc(x,y) is an arc through that point)
3.3V: length 113.6
  Top Layer w0.152: R6.2 35.01,15.17 35.63,14.55 35.63,12.05 35.01,11.43 R7.2
  Top Layer w0.221: 24.85,18.45 24.85,18.42 24.29,17.86 20.98,17.86 20.4,17.28 C12.2
  Top Layer w0.249: C14.2 v1(8.37,18.75) U1.48 ; C11.2 20.53,10.28 20.53,7.27 v1(21.34,6.46) 22.84,4.96 v1(24.08,4.96) 24.08,6.41 24.52,6.85 U6.1 26.85,6.85 27.11,7.1 v1(27.11,10.33) ; v1(11.23,15.38) 11.23,10.34 10.75,9.86 9.44,9.86 8.83,9.25 ; U4.1 27.11,20.78 ; 27.11,20.78 27.11,17.3 ; 27.11,20.78 27.11,24.01 26.85,24.27 U2.1 24.97,24.27 24.85,24.15 ; C12.2 19.97,16.75 U1.32 v1(16.75,16.75) ; U8.1 C20.1 24.85,3.46 v1(24.32,4) ; 8.83,9.25 6.85,9.25 6.85,8.25 7.07,8.04 ; 8.83,9.25 U1.1 ; R7.2 34.73,10.56 v1(34.17,10.56) ; 17.19,5.1 17.2,5.1 v1(17.76,4.55) ; U5.1 27.11,13.81 ; 27.11,13.81 27.11,17.3 ; 27.11,13.81 v1(27.11,10.33) ; 27.11,17.3 U7.1 25.75,17.3 25.48,17.56 25.48,17.81 24.85,18.45 C19.1 ; 17.01,5.1 16.43,5.68 15.52,5.68 14.83,6.37 U1.13 ; 24.85,10.25 24.93,10.33 U3.1 v1(27.11,10.33) ; U1.19 20.4,10.25
  Top Layer w0.254: v1(5.31,23.73) 6.13,22.92 6.13,19.57 6.86,18.83 C14.2 6.86,18.65 5.92,17.71 5.67,17.71 P1.14
  Bottom Layer w0.249: v1(24.32,4) 24.08,4.23 v1(24.08,4.96) ; v1(8.37,18.75) 9,18.13 9,16.77 10.39,15.38 v1(11.23,15.38) ; v1(16.75,16.75) 16.42,16.75 15.22,15.55 ; v1(34.17,10.56) 34.16,10.55 27.33,10.55 v1(27.11,10.33)
  Bottom Layer w0.254: v1(5.31,23.73) 4.87,24.18 2.8,24.18 ; v1(17.76,4.55) 19.42,4.55 v1(21.34,6.46) ; v1(11.23,15.38) 11.59,15.38 12,14.97 14.64,14.97 15.22,15.55
5V: length 62.5
  Top Layer w0.249: v1(17.35,19.8) 17.77,20.21 19.63,20.21 20.3,20.88 R23.2 ; 12.9,23.04 14.23,23.04 C3.1 14.48,22.92 15.09,23.53 19.97,23.53 R22.2 ; v1(15.17,9.35) 14.33,10.19 14.33,15.74 v1(13.46,16.61) ; R2.1 v1(17.1,1.83)
  Top Layer w0.508: P1.16 4.13,21.81 3.66,22.29 3.66,23.5 3.85,23.69 3.85,24.51 v2(4.49,25.14) ; R23.2 R22.2 20.3,24.82 v2(19.98,25.14)
  Bottom Layer w0.249: v1(13.46,16.61) 13.46,17.67 15.02,19.23 16.79,19.23 v1(17.35,19.8) ; v1(17.1,1.83) 15.17,3.76 v1(15.17,9.35)
  Bottom Layer w0.508: v2(4.49,25.14) v2(19.98,25.14)
5V_I: length 25.8
  Top Layer w0.249: R23.1 21.9,21.64 R10.1
  Top Layer w0.254: R21.2 39.77,24.7 v2(39.14,24.08)
  Top Layer w0.508: Q2.5 39.59,22.45 39.14,22.9 v2(39.14,24.08) ; v2(34.47,25.08) 23.01,25.08 22,24.07 R22.1 R23.1
  Bottom Layer w0.508: v2(34.47,25.08) 38.14,25.08 v2(39.14,24.08)
5V_OUT: length 52.5
  Top Layer w0.152: 38.87,19.72 39.71,19.72 40.19,19.24 40.19,4.45 40.98,3.67 40.98,1.23 40.65,0.9 20.63,0.9 19.75,1.78 R8.1
  Top Layer w0.249: 38.87,20.97 35.24,20.97 R18.1
  Top Layer w0.508: Q2.2 38.53,22.45 38.87,22.11 38.87,19.72 P2.19
GND: length 71.8
  Top Layer w0.249: v1(34.35,19.72) R46.2 ; R14.2 R11.2 ; R11.2 R3.2 ; R11.2 v1(14.47,1.83) ; v1(13.14,4.29) C10.1 C4.1 ; 38.8,3.36 40.16,3.36 R16.2 ; v1(5.58,9.75) U1.63 ; v1(9.33,6.01) U1.2 ; v1(34.35,18.24) R47.2 ; v1(29.34,22.31) 29.34,22.77 ; v1(28.43,1.86) 29.34,1.86 ; 8.5,21.09 v1(7.53,21.09) ; C7.1 v1(14.46,4.29) ; v1(29.34,8.37) 29.34,8.83 ; v1(19.57,9.75) U1.18 ; v1(25.58,8.83) U3.4 ; v1(30,6.35) 29.34,6.35 ; v1(27.16,1.86) U8.4 ; v1(25.58,13.31) U5.2 ; C9.1 v1(16.72,24.52) R15.2 ; X1.4 7.73,5.52 ; v1(8.07,11.25) U1.60 ; v1(32.23,10.13) C22.1 ; C19.2 v1(23.98,18.52) ; C2.1 C13.1 v1(17.11,4.29) ; R43.2 v1(18.95,22.13) ; v1(26.24,4.89) U6.4 ; v1(31.57,4.93) C24.1 ; v1(31.57,24.15) C21.1 ; C11.1 v1(22.63,10.4) C18.2 ; v1(22.54,17.18) C12.1 C8.1 ; X1.2 5.98,0.7 ; v1(34.35,4.93) R48.2 ; v1(26.24,22.31) U2.4 ; C15.1 v1(5.36,8.67) ; v1(14.33,8.5) U1.12 ; v1(26.24,18.82) U4.4 ; C17.2 v1(23.35,23.26) ; 38.67,3.48 38.72,3.43 ; R1.2 v1(4.73,21.34) ; R9.2 v1(18.43,1.83) ; v1(34.35,9.37) R49.2 ; 35.01,7.08 R45.2 ; C1.1 v1(15.79,4.29) ; v1(35.01,7.16) R44.2 ; R50.2 v1(36.94,4.22) 37.78,3.38 Q1.2 ; C3.2 v1(16.62,22.79) ; v1(26.24,15.34) U7.4 ; R5.2 v1(13.58,24.52) ; v1(31.57,16.75) C23.1 ; v1(25.58,6.35) U6.2 ; v1(28.71,13.31) 29.34,13.31 ; C20.2 v1(22.71,3.36) ; v1(26.24,11.86) U5.4
  Top Layer w0.254: C14.1 C16.1 R1.2
  Top Layer w0.355: v1(34.43,20.45) v1(35.71,20.45)
  Top Layer w0.508: v1(10.98,5.3) 10.98,2.59 9.09,0.7 v1(6.85,0.7) 5.24,0.7 4.73,1.22 v1(4.73,3.05) 4.73,5.02 5.23,5.52 v1(6.85,5.52) v1(8.62,5.52) 8.97,5.52 C5.2
ADC_5V: length 8.4
  Top Layer w0.203: C1.2 15.89,5.1 16.44,4.56 16.44,3.06 15.88,2.49 15.8,2.49 ; 17.1,2.49 17.01,2.49 16.45,3.06
  Top Layer w0.249: 17.18,2.49 17.19,2.49 v1(17.75,1.94) ; U1.11 13.83,6.2 14.15,5.88 14.81,5.88 15.58,5.1 C1.2
ADC_5V_I: length 31.1
  Top Layer w0.203: C7.2 14.57,5.1 15.12,4.56 15.12,3.06 14.55,2.49
  Top Layer w0.249: v1(15.12,1.94) 14.57,2.49 R11.1 ; v1(13.59,15.83) 13.59,9.58 v1(13.82,9.35) ; v1(17.76,19.47) 18.16,19.86 R10.2 ; C7.2 14.26,5.1 13.54,5.83 13.14,5.83 12.83,6.13 U1.9
  Bottom Layer w0.249: v1(15.12,1.94) 13.82,3.23 v1(13.82,9.35) ; v1(13.59,15.83) 13.89,16.13 13.89,17.6 15.17,18.88 17.18,18.88 v1(17.76,19.47)
ADC_5VO: length 8.7
  Top Layer w0.203: 19.09,4.55 19.64,5.1 R8.2 ; 19.09,4.55 19.09,3.06 18.52,2.49 18.44,2.49 ; 19.09,4.55 18.54,5.1 C2.2 18.35,5.1 17.45,6.01 15.7,6.01 15.33,6.38 U1.14
ADC_VREF: length 7.2
  Top Layer w0.203: C10.2 13.25,5.1 13.8,4.56 13.8,3.06 13.23,2.49 R14.1
  Top Layer w0.249: R13.2 R14.1 ; U1.8 12.33,5.8 13.02,5.1 C10.2
DAC_VREF: length 21.4
  Top Layer w0.249: v1(15.78,11.64) 16.67,10.75 U1.20 ; v1(9.64,21.74) U9.3 7.21,21.74 6.86,21.39 R1.1
  Top Layer w0.254: v1(12.4,16.47) 12.73,16.14 v1(12.73,11.64)
  Bottom Layer w0.254: v1(9.64,21.74) 9.96,21.42 9.96,17 10.5,16.47 v1(12.4,16.47) ; v1(15.78,11.64) v1(12.73,11.64)
J_LED_GREEN: length 34.8
  Top Layer w0.249: v1(17.08,15.75) U1.30 ; 33.53,12.66 v1(33.53,11.97)
  Bottom Layer w0.152: P1.8 5.05,12.37 7.68,15 11.41,15 11.74,14.67 14.94,14.67 16.03,15.75 v1(17.08,15.75)
  Bottom Layer w0.249: v1(33.53,11.97) 33.53,12.33 31.88,13.98 19.21,13.98 17.44,15.75 v1(17.08,15.75)
J_LED_RED: length 33
  Top Layer w0.249: v1(19.57,15.25) U1.29 v1(17.06,15.25) ; v1(33.53,14.06) D1.1
  Bottom Layer w0.152: P1.6 7.78,14.74 11.31,14.74 11.72,14.33 14.97,14.33 15.88,15.25 v1(17.06,15.25)
  Bottom Layer w0.249: v1(33.53,14.06) 31.83,15.77 20.09,15.77 v1(19.57,15.25)
J_RST: length 25.8
  Top Layer w0.152: v1(8.4,8.38) 7.37,7.35 2.62,7.35 1.81,8.16 1.81,18.11 P3.5 ; v1(9.26,8.73) 11.59,8.73 v1(11.83,8.5)
  Top Layer w0.249: v1(11.83,8.5) U1.7 11.83,5.12 C4.2
  Bottom Layer w0.152: v1(8.4,8.38) 8.75,8.73 v1(9.26,8.73)
J_SWC: length 8
  Top Layer w0.249: v1(8.07,16.75) U1.49
  Bottom Layer w0.152: P3.4 3.71,20.37 7.33,16.75 v1(8.07,16.75)
J_SWD: length 9.9
  Top Layer w0.152: U1.46 9.83,17.63 9.71,17.51 8.69,17.51 8.44,17.76 v1(6.99,17.76)
  Bottom Layer w0.152: v1(6.99,17.76) 6.67,17.76 P3.3
J_USB_DM: length 15.7
  Top Layer w0.152: P1.2 4.81,9.23 4.81,10.14 5.35,10.68 5.35,16.6 5.88,17.13 8.26,17.13 8.44,16.95 10.14,16.95 10.83,17.64 U1.44
J_USB_DP: length 14.2
  Top Layer w0.152: U1.45 10.33,17.65 9.88,17.2 8.55,17.2 8.37,17.38 5.77,17.38 5.1,16.71 5.1,10.79 P1.4
JP1: length 13
  Top Layer w0.152: v1(9.39,13.9) 9.05,14.24 9.05,14.67 7.96,15.75 U1.51 ; v1(16.27,13.9) 16.77,13.9 16.94,13.73 18.31,13.73 U1.26
  Bottom Layer w0.152: 9.39,13.93 9.84,13.47 15.84,13.47 v1(16.27,13.9)
MCU_PWR: length 36
  Top Layer w0.249: D3.3 v1(32.89,23.72) ; U1.59 7.99,11.75 10.67,14.43 v1(10.67,16.9)
  Bottom Layer w0.249: v1(32.89,23.72) 32.27,23.1 23.91,23.1 23.5,22.69 22.44,22.69 21.44,21.7 18.33,21.7 18.12,21.9 11.49,21.9 10.67,21.09 v1(10.67,16.9)
MCU_RST1: length 19.3
  Top Layer w0.249: v1(17.07,12.05) 17.07,13.06 17.26,13.25 U1.25 ; v1(17.94,6.31) 18.5,5.75 20.25,5.75 21.21,4.78 21.21,3.51 22.59,2.14 25.56,2.14 25.78,2.36 U8.3
  Bottom Layer w0.249: v1(17.07,12.05) 17.07,7.17 v1(17.94,6.31)
MCU_RST2: length 40.2
  Top Layer w0.249: v1(20.23,1.91) 20.91,1.23 37.37,1.23 37.62,1.48 Q1.1 38.8,1.61 40.16,1.61 R16.1 ; v1(10.56,10.34) 10.15,10.75 U1.61
  Bottom Layer w0.249: v1(20.23,1.91) 19.16,2.98 17.77,2.98 15.6,5.16 15.6,9.53 14.78,10.34 v1(10.56,10.34)
MCU_RTCK: length 12.2
  Top Layer w0.249: R29.1 23.35,14.95 22.65,14.25 U1.27 17.2,14.25 16.33,15.12 U1.33
MCU_RXD: length 6.7
  Top Layer w0.249: U1.28 22.11,14.75 22.64,15.27 22.64,16.37 23.35,17.08 R28.1
MCU_TCK1: length 22.1
  Top Layer w0.249: U1.37 14.33,19.82 14.53,20.02 15.62,20.02 15.83,19.82 U1.34 15.83,12.41 16.98,11.25 U1.21 20.84,11.25 21.14,10.95 21.14,8.19 23.35,5.98 R27.1
MCU_TCK2: length 21.4
  Top Layer w0.249: v1(20,8.7) 17.38,8.7 14.81,11.26 14.81,15.94 13.67,17.08 13.16,17.08 12.83,17.41 U1.40 ; U3.3 25.7,9.33 25.62,9.26 25.34,9.26 24.78,8.7 v1(21.57,8.7)
  Bottom Layer w0.249: v1(20,8.7) v1(21.57,8.7)
MCU_TDI1: length 11.4
  Top Layer w0.249: R24.1 23.35,21.12 22.61,20.38 22.61,19.41 22.08,18.88 v1(18.88,18.88) ; v1(15.33,17.53) U1.35
  Bottom Layer w0.249: v1(18.88,18.88) 17.76,17.76 15.56,17.76 v1(15.33,17.53)
MCU_TDI2: length 16.6
  Top Layer w0.249: U1.41 12.33,19.83 v1(12.73,20.23) ; U2.2 25.82,23.77 24.75,22.69 24.54,22.69 v1(24.19,22.34)
  Bottom Layer w0.249: v1(12.73,20.23) 13.07,20.57 22.41,20.57 v1(24.19,22.34)
MCU_TDO: length 37.5
  Top Layer w0.249: v1(15.35,12.71) 15.35,16.71 14.83,17.23 U1.36 ; 14.83,17.23 14.2,17.23 13.83,17.61 U1.38 ; v1(16.82,6.77) 18.14,6.77 18.7,6.21 20.29,6.21 21.65,4.85 21.65,3.72 22.74,2.62 25.43,2.62 25.67,2.86 U8.2 ; v1(8.62,13.14) 8.62,14.18 8.05,14.75 U1.53
  Bottom Layer w0.249: v1(16.82,6.77) 16.62,6.96 16.62,12.26 16.17,12.71 v1(15.35,12.71) 9.05,12.71 v1(8.62,13.14)
MCU_TMS1: length 5.5
  Top Layer w0.249: R26.1 23.35,12.71 22.39,11.75 U1.22
MCU_TMS2: length 12.1
  Top Layer w0.249: U3.2 25.6,9.83 25.43,9.66 24.26,9.66 24.06,9.86 24.06,13.29 23.83,13.52 22.92,13.52 21.64,12.25 U1.23
MCU_TRST1: length 12.8
  Top Layer w0.249: R25.1 23.35,19.64 22.16,18.46 18.08,18.46 16.17,20.37 13.89,20.37 13.33,19.81 U1.39
MCU_TRST2: length 17.5
  Top Layer w0.249: v1(12.19,20.5) 11.8,20.5 11.33,20.03 U1.43 ; v1(22.76,21.91) 24.5,21.91 25.85,23.27 U2.3
  Bottom Layer w0.249: v1(22.76,21.91) 21.76,20.92 12.6,20.92 v1(12.19,20.5)
RTCK: length 12.6
  Top Layer w0.152: P2.11 36.93,12.7 36.93,10.53 36.19,9.79 35.68,9.79 35.38,10.09 34.14,10.09 33.51,9.46
  Top Layer w0.249: R39.2 32.23,13.69 32.85,13.06 32.85,10.12 33.51,9.46 R49.1
RTCK_RXD_DIR: length 22.5
  Top Layer w0.249: v1(19.61,7.65) 17.32,7.65 16.48,8.49 16.19,8.49 15.83,8.14 U1.15 ; v1(27.62,7.65) 27.62,10.5 28.2,11.08 28.2,15.43 28.57,15.8 29.34,15.8
  Bottom Layer w0.249: v1(19.61,7.65) v1(27.62,7.65)
RXD: length 8.7
  Top Layer w0.152: 33.51,16.65 34.14,16.01 36.43,16.01 P2.17
  Top Layer w0.249: R38.2 32.23,15.36 33.51,16.65 R42.1 R47.1
SRST: length 18.5
  Top Layer w0.152: R19.2 33.51,3.54 34.14,4.17 35.67,4.17 36.22,4.73 v1(36.22,8.16) ; P2.15 36.42,14.73 36.42,11.3 v1(35.83,10.71)
  Top Layer w0.249: R41.2 R20.2 R19.2
  Bottom Layer w0.152: v1(35.83,10.71) 36.22,10.32 v1(36.22,8.16)
TCK: length 11.1
  Top Layer w0.152: R45.1 33.51,6.5 34.27,7.27 34.27,8.42 34.47,8.62 35.44,8.62 37.19,10.37 37.19,11.69 P2.9
  Top Layer w0.249: R33.2 R37.2 R45.1
TCK_DIR: length 14.5
  Top Layer w0.249: 29.34,5.35 28.51,5.35 27.62,4.45 22.54,4.45 20.35,6.64 19,6.64 18.45,7.19 16.39,7.19 U1.16
TDI: length 17.1
  Top Layer w0.152: 36.15,15.63 36.15,15.63 36.15,11.68 v1(36.04,11.57) ; v1(36.15,16.45) 36.15,18.3 35.47,18.98 34.17,18.98 33.51,19.64 R46.1
  Top Layer w0.249: R46.1 33.51,19.81 32.87,20.45 ; 32.87,20.45 32.87,22.03 R30.2 ; 32.87,20.45 32.23,19.8 R34.2
  Bottom Layer w0.152: P2.5 37.78,9.83 v1(36.04,11.57) ; v1(36.15,15.63) v1(36.15,16.45)
TDO: length 14.5
  Top Layer w0.152: v1(35.67,8.18) 35.67,5.88 35.44,5.65 34.14,5.65 33.51,5.01 R48.1 ; v1(35.84,10.17) 35.84,10.17 36.68,11.01 36.68,13.72 P2.13
  Top Layer w0.249: R40.2 32.23,3.55 33.51,4.84 R48.1
  Bottom Layer w0.152: v1(35.84,10.17) 35.84,9.3 35.67,9.13 v1(35.67,8.18)
TMS: length 12.5
  Top Layer w0.249: R44.1 33.51,8.09 R32.2 31.48,10.12 v1(31.48,11.48) 32.23,12.23 R36.2
  Bottom Layer w0.152: v1(31.48,11.48) 35.2,11.48 35.67,11.95 37.01,11.95 P2.7
TMS_DIR: length 21.4
  Top Layer w0.249: U1.10 13.33,8.38 13.87,8.92 16.55,8.92 17.34,8.14 v1(20,8.14) ; 29.34,12.31 28.87,12.31 28.55,12 28.55,10.75 28.05,10.25 v1(28.05,8.14)
  Bottom Layer w0.249: v1(20,8.14) v1(28.05,8.14)
TRST: length 20.6
  Top Layer w0.152: R50.1 38.44,5.03 37.14,6.34 37.14,7.83 P2.3 ; v1(35.69,11.21) 35.66,11.24 35.66,11.72 35.9,11.96 35.9,14.92 v1(35.66,15.16)
  Top Layer w0.249: R31.2 32.23,21.13 31.48,20.38 31.48,19.11 32.23,18.36 R35.2 32.23,18.14 v1(32.78,17.58)
  Bottom Layer w0.152: v1(35.66,15.16) 35.27,15.54 34.83,15.54 v1(32.78,17.58) ; P2.3 36.78,9.64 36.78,10.29 35.86,11.21 v1(35.69,11.21)
TRST_TDI_DIR: length 19.5
  Top Layer w0.249: 29.34,19.28 28.35,19.28 27.67,18.6 v1(27.67,11.21) ; v1(19.98,9.25) U1.17
  Bottom Layer w0.249: v1(27.67,11.21) 25.48,11.21 23.52,9.25 v1(19.98,9.25)
VIO: length 69
  Top Layer w0.249: v1(30.54,11.57) 30.54,11.03 C22.2 30.73,10.76 30.3,10.33 28.83,10.33 28.48,9.97 28.48,7.21 28.84,6.85 29.83,6.85 30.16,7.17 31.2,7.17 31.48,6.89 v1(31.48,5.75) 30.73,5 C24.2 30.05,4.25 30.05,3.62 29.8,3.36 29.34,3.36 ; 29.34,17.3 30.26,17.3 30.73,16.84 ; C21.2 30.61,24.27 29.08,24.27 28.83,24.52 v1(28.48,24.52) 28.48,21.14 28.84,20.78 v1(30.03,20.78) ; v1(31.48,17.59) 30.73,16.84 ; 30.73,16.84 C23.2 30.73,16.63 31.48,15.88 v1(31.48,13.06) 30.31,13.06 30.03,13.34 30.03,13.6 29.81,13.81 29.34,13.81 ; v1(34.35,16.75) R42.2 ; v1(34.35,3.46) R19.1
  Top Layer w0.381: R12.1 8.39,24.51 R4.1 8.4,24.64 9.1,25.33 13.75,25.33 14.48,24.6 14.48,24.57 ; 14.48,24.57 R15.1 ; 14.48,24.57 15.25,25.33 18.14,25.33 v1(19.51,23.97)
  Bottom Layer w0.249: v1(31.48,5.75) 33.77,3.46 v1(34.35,3.46) ; v1(30.03,20.78) 31.48,19.33 v1(31.48,17.59) 32.18,17.59 32.61,18.01 33.09,18.01 v1(34.35,16.75) ; v1(30.54,11.57) 30.54,12.12 v1(31.48,13.06)
  Bottom Layer w0.381: v1(19.51,23.97) 21.17,23.97 21.72,24.52 v1(28.48,24.52)
VREF: length 37.9
  Top Layer w0.152: v1(34.35,11.08) 34.35,11.33 v1(34.94,11.92)
  Top Layer w0.249: R17.2 R43.1 v1(18.08,21.34)
  Bottom Layer w0.152: v1(34.35,11.08) 35.29,10.14 35.29,8.02 36.02,7.29 P2.1 ; v1(34.94,11.92) 36.53,13.51 36.53,18.98 32.73,22.78 24.09,22.78 23.65,22.34 22.58,22.34 21.58,21.34 v1(18.08,21.34)
VREF_BUF: length 24.5
  Top Layer w0.249: v1(11.23,20.94) 11.23,21.27 11.72,21.75 ; R13.1 v1(11.82,1.83) ; 11.72,21.75 11.72,22.18 11.92,22.39 12.9,22.39 ; 11.72,21.75 11.72,21.74 12.9,21.74 ; v1(11.82,9.18) v1(11.82,16.95)
  Bottom Layer w0.249: v1(11.82,1.83) 12.25,2.27 12.25,8.74 v1(11.82,9.18) ; v1(11.23,20.94) 11.23,17.54 v1(11.82,16.95)
$1N1650: length 2.9
  Top Layer w0.249: 29.34,23.27 29.71,23.27 30.03,22.95 30.03,21.9 R31.1
$1N1652: length 1.9
  Top Layer w0.249: R30.1 30.73,22.81 29.77,23.77 29.34,23.77
$1N2320: length 1.6
  Top Layer w0.249: R32.1 30.73,9.46 30.35,9.83 29.34,9.83
$1N2323: length 2.3
  Top Layer w0.249: 29.34,9.33 29.88,9.33 30.05,9.15 30.05,8.7 30.73,8.02 R33.1
$1N2654: length 1.6
  Top Layer w0.249: R34.1 30.17,20.28 29.34,20.28
$1N2657: length 2.4
  Top Layer w0.249: 29.34,19.78 29.84,19.78 30.03,19.59 30.03,18.94 R35.1
$1N2922: length 1.6
  Top Layer w0.249: 29.34,12.81 29.72,12.81 30.2,12.33 R36.1
$1N3257: length 1.9
  Top Layer w0.249: R24.2 24.85,21.09 25.66,20.28 U4.2
$1N3292: length 1.4
  Top Layer w0.249: R25.2 24.94,19.78 U4.3
$1N3327: length 1.4
  Top Layer w0.249: U5.3 R26.2
$1N3604: length 1.4
  Top Layer w0.249: U6.3 R27.2
$1N3606: length 1.6
  Top Layer w0.249: R37.1 30.16,5.85 29.34,5.85
$1N3911: length 2.2
  Top Layer w0.178: R38.1 30.73,15.42 30.26,15.88 30.26,16.15 29.61,16.8 29.34,16.8
$1N3912: length 3.2
  Top Layer w0.178: 29.34,16.3 29.63,16.3 29.96,15.97 29.96,14.58 R39.1
$1N3913: length 1.6
  Top Layer w0.249: R28.2 24.85,17.13 25.18,16.8 U7.2
$1N3915: length 1.6
  Top Layer w0.249: U7.3 25.23,16.3 24.85,15.91 R29.2
$1N4922: length 1.6
  Top Layer w0.249: 29.34,2.86 30.13,2.86 R40.1
$1N4923: length 1.5
  Top Layer w0.249: R41.1 30.35,2.36 29.34,2.36
$1N5088: length 8.3
  Top Layer w0.249: X1.1 5.98,4.07 6.86,3.18 8.97,3.18 C5.1 9.47,3.6 10.11,4.25 10.11,5.65 10.83,6.37 U1.5
$1N5089: length 7.5
  Top Layer w0.249: X1.3 8.27,2.49 C6.2 9.52,2.49 10.47,3.43 10.47,5.51 11.33,6.37 U1.6
$1N5338: length 3.6
  Top Layer w0.249: C16.2 9.11,20.04 9.33,19.82 U1.47
$1N5416: length 2.2
  Top Layer w0.249: U1.31 20,16.25 C8.2
$1N6080: length 2.5
  Top Layer w0.249: D1.4 34.87,13.43 34.26,14.04 34.26,14.44 33.51,15.19 R6.1
$1N6144: length 2.4
  Top Layer w0.249: D1.3 34.88,12.58 34.27,11.97 34.27,11.72 33.51,10.95 33.51,10.88
$1N6676: length 1.7
  Top Layer w0.249: 12.9,21.09 14.23,21.09 R17.1
$1N6686: length 4.8
  Top Layer w0.249: R5.1 R4.2 9.9,22.78 9.51,22.39 8.5,22.39
$1N9976: length 1.6
  Top Layer w0.381: 6.9,22.93 7.02,23.04 8.5,23.04
$1N10015: length 1.9
  Top Layer w0.381: D2.1 4.56,23.7 R12.2
$1N10974: length 4.2
  Top Layer w0.249: R21.1 38.27,23.8 37.87,23.4 Q2.1 37.3,23.4 36.03,24.67 D3.2
$1N10976: length 5.3
  Top Layer w0.249: Q2.3 37.32,21.5 36.05,22.77 D3.1 35.49,22.77 34.85,22.13 34.44,22.13 R18.2
$1N10979: length 3.7
  Top Layer w0.508: Q2.6 41.13,23.4 41.48,23.05 41.48,21.85 41.13,21.5 Q2.4
$1N11150: length 1.9
  Top Layer w0.249: R20.1 35.93,1.98 36.38,2.43 Q1.3

## Copper pours and planes (outline as drawn; the poured copper is in the pictures)
GND on Bottom Layer: 0,28.5 0.01,28.61 0.06,28.74 0.15,28.85 0.26,28.94 0.39,28.99 0.5,29 41.5,29 41.61,28.99 41.74,28.94 41.85,28.85 41.94,28.74 41.99,28.61 42,28.5 42,-2.5 41.99,-2.61 41.94,-2.74 41.85,-2.85 41.74,-2.94 41.61,-2.99 41.5,-3 0.5,-3 0.39,-2.99 0.26,-2.94 0.15,-2.85 0.06,-2.74 0.01,-2.61 0,-2.5

Small or netless copper shapes (teardrops, artwork), in the pictures only: 506 on Top Layer, 96 on Bottom Layer

## Text on the board
Top Silkscreen Layer: 24/10/04 Peace | JLCJLCJLCJLC | RCDGV | X-Link V9
